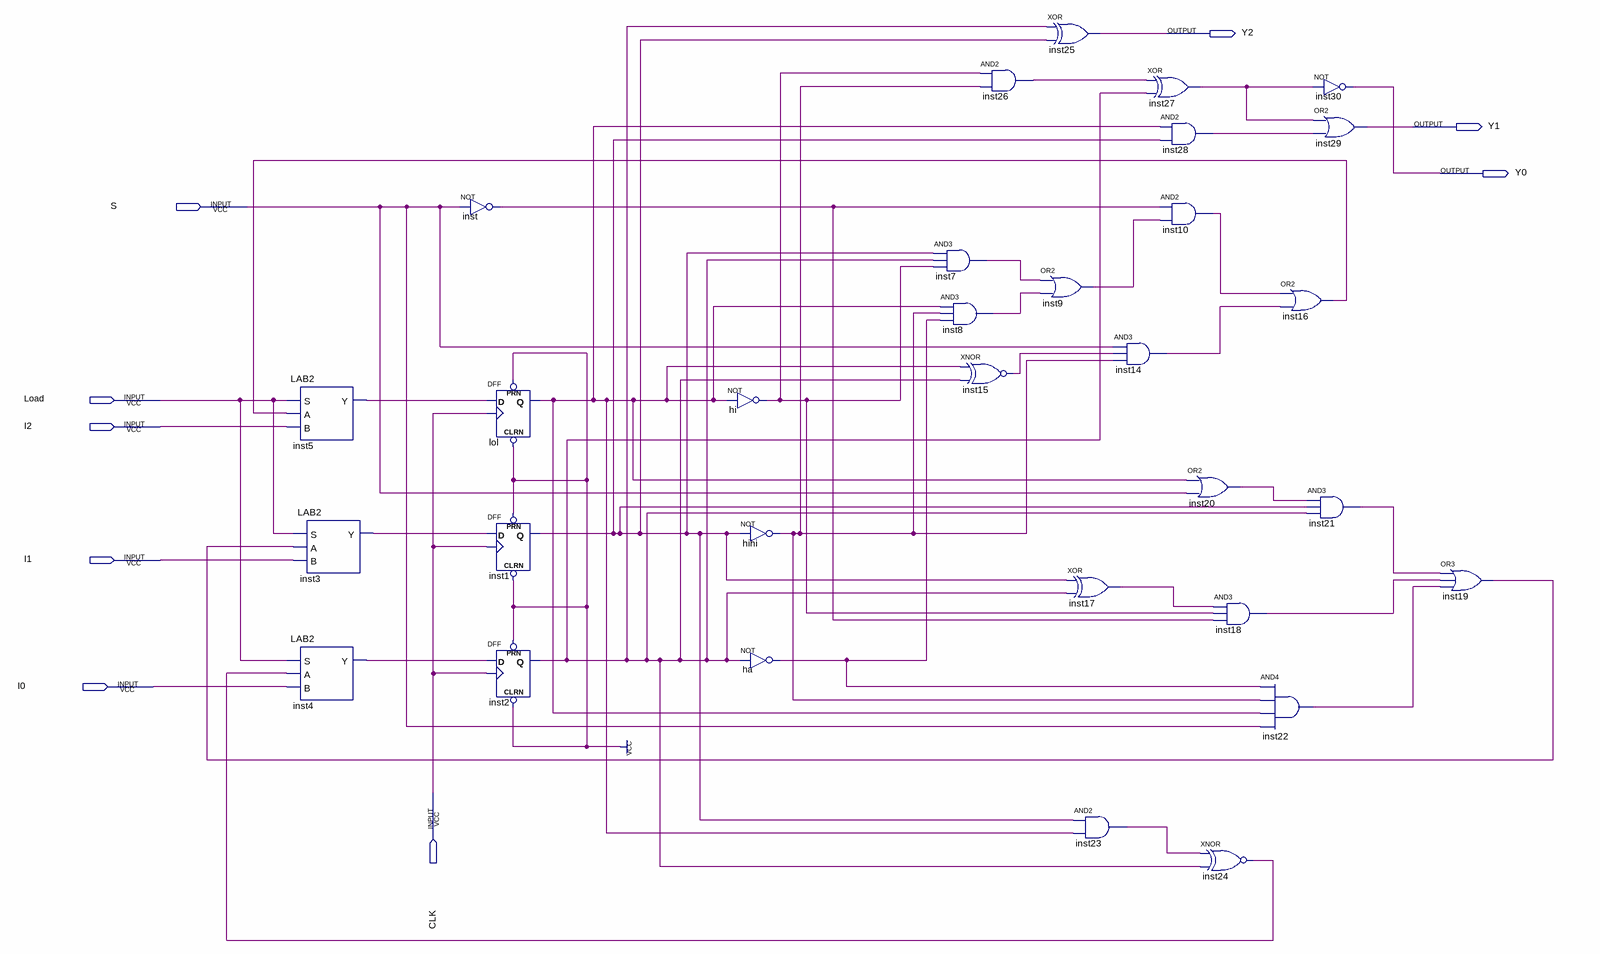
[diagram p0: schematic sheet]
// Quartus schematic lab1_3.bdf as structural Verilog: 31 symbols, 9 pins
module lab1_3 (
  input  S,
  input  Load,
  input  I2,
  input  I1,
  input  I0,
  input  CLK,
  output Y2,
  output Y1,
  output Y0
);

  wire ha_out, hi_out, hihi_out, inst1_q, inst2_q, inst3_y, inst4_y, inst5_y, inst7_out, inst8_out,
       inst9_out, inst10_out, inst14_out, inst15_out, inst16_out, inst17_out, inst18_out, inst19_out,
       inst20_out, inst21_out, inst22_out, inst23_out, inst24_out, inst26_out, inst27_out, inst28_out,
       inst_out, lol_q;

  LAB2 inst5 (.S(Load), .A(inst16_out), .B(I2), .Y(inst5_y));
  LAB2 inst3 (.S(Load), .A(inst19_out), .B(I1), .Y(inst3_y));
  LAB2 inst4 (.S(Load), .A(inst24_out), .B(I0), .Y(inst4_y));
  not inst (inst_out, S);
  DFF lol (.CLRN(1'b1), .CLK(CLK), .D(inst5_y), .PRN(1'b1), .Q(lol_q));
  DFF inst1 (.CLRN(1'b1), .CLK(CLK), .D(inst3_y), .PRN(1'b1), .Q(inst1_q));
  DFF inst2 (.CLRN(1'b1), .CLK(CLK), .D(inst4_y), .PRN(1'b1), .Q(inst2_q));
  not hi (hi_out, lol_q);
  not hihi (hihi_out, inst1_q);
  not ha (ha_out, inst2_q);
  and inst7 (inst7_out, inst1_q, inst2_q, hi_out);
  and inst26 (inst26_out, hi_out, hihi_out);
  and inst8 (inst8_out, lol_q, hihi_out, ha_out);
  xnor inst15 (inst15_out, lol_q, inst2_q);
  or inst9 (inst9_out, inst7_out, inst8_out);
  xor inst25 (Y2, inst2_q, inst1_q);
  xor inst17 (inst17_out, inst1_q, inst2_q);
  and inst23 (inst23_out, inst1_q, lol_q);
  xor inst27 (inst27_out, inst26_out, inst2_q);
  and inst14 (inst14_out, S, inst15_out, hihi_out);
  and inst28 (inst28_out, lol_q, inst1_q);
  and inst10 (inst10_out, inst_out, inst9_out);
  or inst20 (inst20_out, lol_q, S);
  xnor inst24 (inst24_out, inst23_out, inst2_q);
  and inst18 (inst18_out, inst17_out, hi_out, inst_out);
  or inst16 (inst16_out, inst10_out, inst14_out);
  and inst21 (inst21_out, inst20_out, inst1_q, inst2_q);
  and inst22 (inst22_out, ha_out, hihi_out, lol_q, S);
  not inst30 (Y0, inst27_out);
  or inst29 (Y1, inst27_out, inst28_out);
  or inst19 (inst19_out, inst21_out, inst18_out, inst22_out);
endmodule
